# EAGLE schematic BreaV7 (EAGLE 9.2.2)

## Sheet 1 of 3
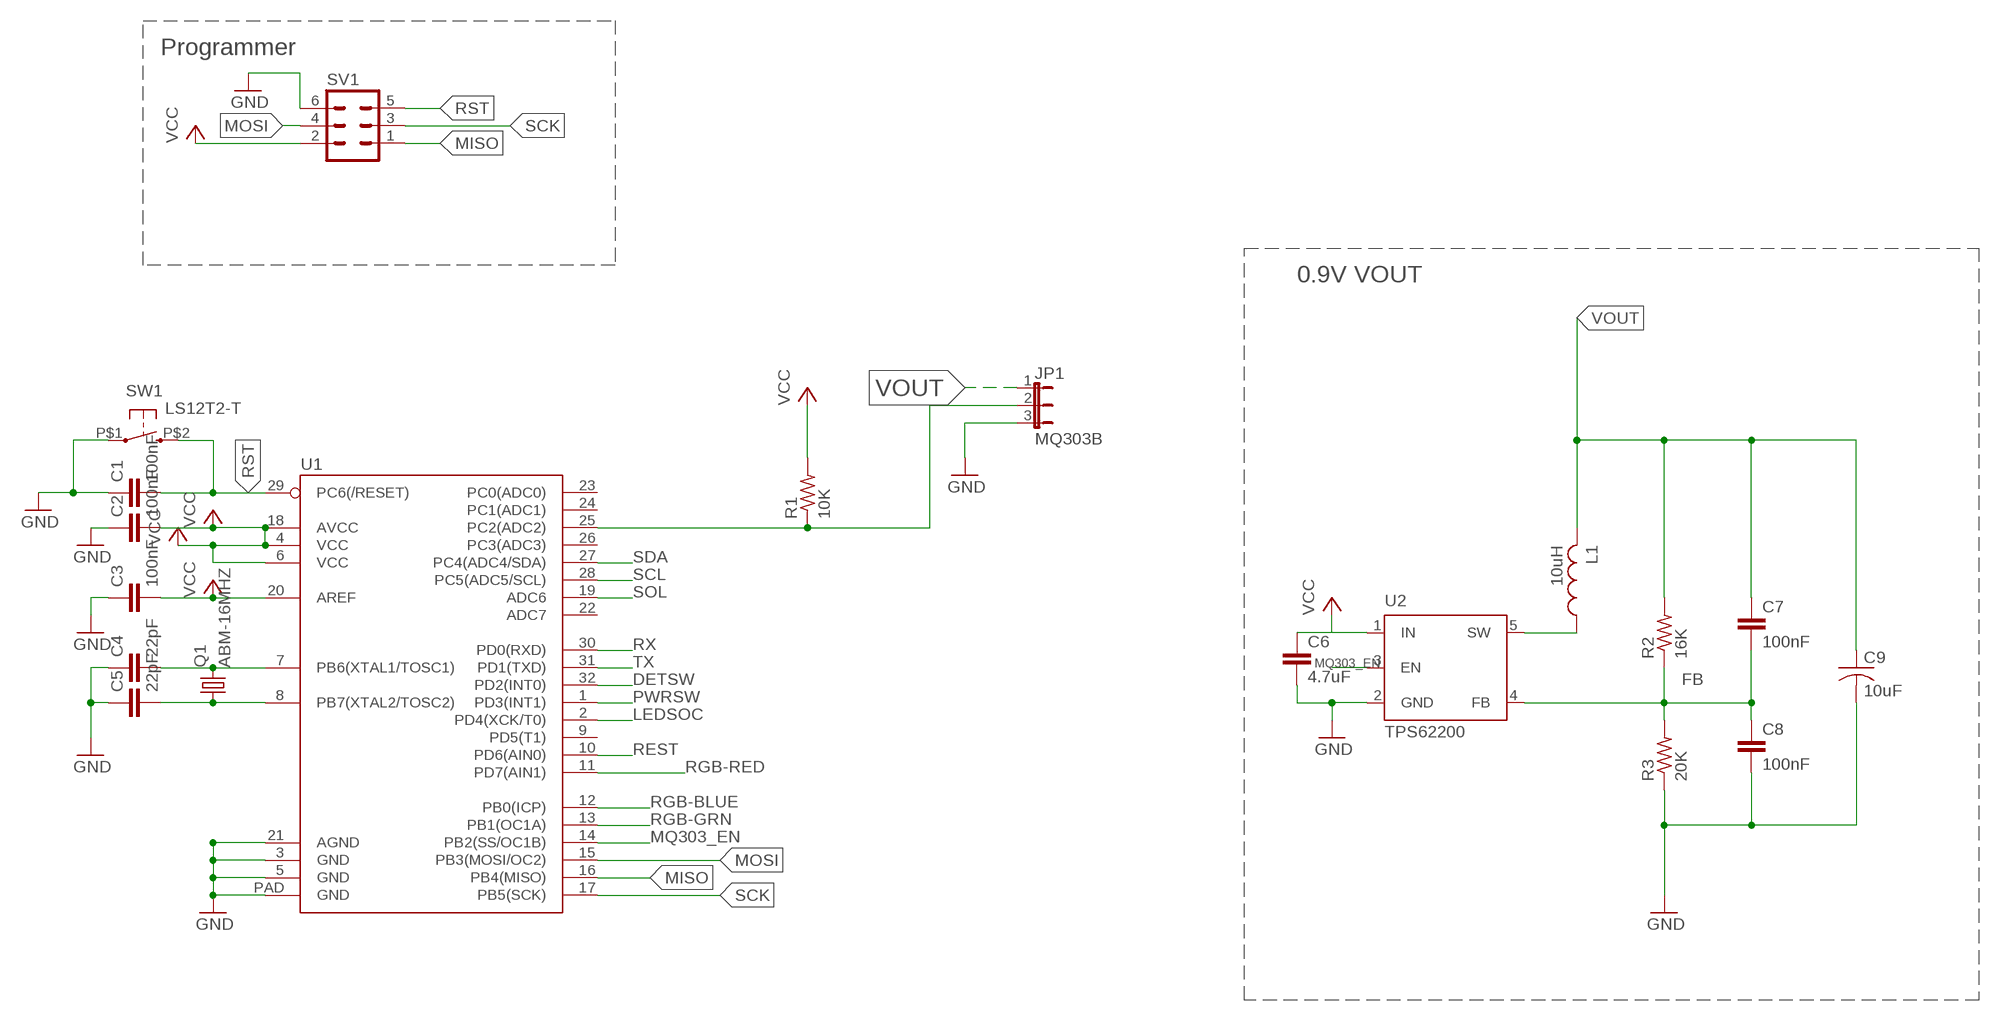
[diagram p0: schematic, sheet 1]

### Parts
C1  100nF  C-EUC0603  [C0603]
C2  100nF  C-EUC0603  [C0603]
C3  100nF  C-EUC0603  [C0603]
C4  22pF  C-EUC0603  [C0603]
C5  22pF  C-EUC0603  [C0603]
C6  4.7uF  C-EUC0402  [C0402]
C7  100nF  C-EUC0402  [C0402]
C8  100nF  C-EUC0402  [C0402]
C9  10uF  C-USC0805K  [C0805K]
JP1  MQ303B  JP2E  [JP2]
L1  10uH  L-USL2825P  [L2825P]
Q1  ABM-16MHZ  [ABM-16MHZ]
R1  10K  R-US_R0402  [R0402]
R2  16K  R-US_R0402  [R0402]
R3  20K  R-US_R0402  [R0402]
SV1  MA03-2  [MA03-2]
SW1  LS12T2-T  [LS12T2-T]
U1  ATMEGA328P_MLFMLF32  [MLF32-PAD]
U2  TPS62200  [TPS62200]

### Nets
DETSW: U1.32(PD2(INT0)) ; also sheet 2
FB: C7.2 C8.1 R2.1 R3.2 U2.4(FB)
GND: C1.1 C2.1 C3.1 C4.1 C5.1 C6.2 C8.2 C9.2 JP1.3 R3.1 SV1.6(MISO) SW1.P$1(S1) U1.3(GND) U1.5(GND) U1.21(AGND) U1.PAD(GND) U2.2(GND) ; also sheet 2,3
LEDSOC: U1.2(PD4(XCK/T0))
MISO: SV1.1 U1.16(PB4(MISO))
MOSI: SV1.4 U1.15(PB3(MOSI/OC2))
MQ303_EN: U1.14(PB2(SS/OC1B)) U2.3(EN)
N$1: C5.2 Q1.P$1 U1.8(PB7(XTAL2/TOSC2))
N$2: C4.2 Q1.P$2 U1.7(PB6(XTAL1/TOSC1))
N$3: JP1.2 R1.1 U1.25(PC2(ADC2))
N$7: C6.1 U2.1(IN)
PWRSW: U1.1(PD3(INT1)) ; also sheet 2
REST: U1.10(PD6(AIN0)) ; also sheet 2
RGB-BLUE: U1.12(PB0(ICP)) ; also sheet 2
RGB-GRN: U1.13(PB1(OC1A)) ; also sheet 2
RGB-RED: U1.11(PD7(AIN1)) ; also sheet 2
RST: C1.2 SV1.5(VTG) SW1.P$2(S2) U1.29(PC6(/RESET))
RX: U1.30(PD0(RXD)) ; also sheet 2
SCK: SV1.3 U1.17(PB5(SCK))
SCL: U1.28(PC5(ADC5/SCL)) ; also sheet 3
SDA: U1.27(PC4(ADC4/SDA)) ; also sheet 3
SOL: U1.19(ADC6) ; also sheet 2
SW: L1.1 U2.5(SW)
TX: U1.31(PD1(TXD)) ; also sheet 2
VCC: C2.2 C3.2 R1.2 SV1.2 U1.4(VCC) U1.6(VCC) U1.18(AVCC) U1.20(AREF) ; also sheet 2,3
VOUT: C7.1 C9.1 JP1.1 L1.2 R2.2
Unconnected: U1.9(PD5(T1)) U1.22(ADC7) U1.23(PC0(ADC0)) U1.24(PC1(ADC1)) U1.26(PC3(ADC3))

### Notes on the sheet
- Programmer
- 0.9V VOUT

## Sheet 2 of 3
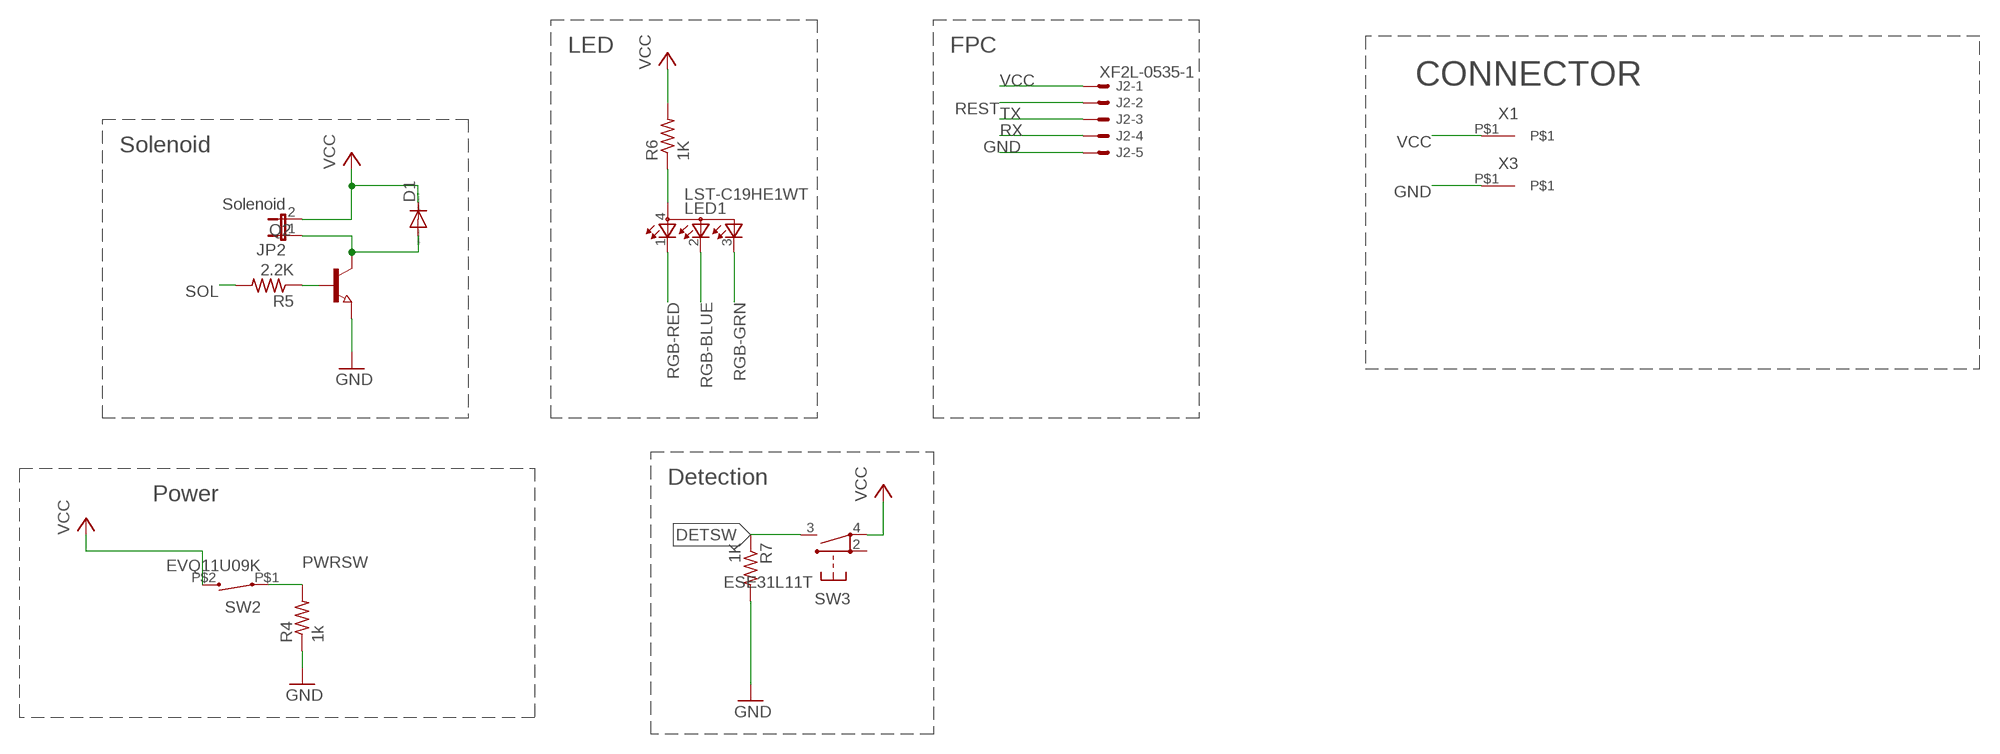
[diagram p1: schematic, sheet 2]

### Parts
D1  DIODE-SOD123  [SOD123]
J2  XF2L-0535-1  [XF2L-0535-1]
JP2  Solenoid  JP1E  [JP1]
LED1  LST-C19HE1WT  [LST-C19HE1WT]
Q2  NPN-TRANSISTOR_SOT23  [SOT23]
R4  1k  R-US_R0402  [R0402]
R5  2.2K  R-US_R0402  [R0402]
R6  1K  R-US_R0402  [R0402]
R7  1K  R-US_R0402  [R0402]
SW2  EVQ11U09K  [EVQ11U-09K]
SW3  ESE31L11T  [SWITCH]
X1  CON-1PIN  [CON-1PIN]
X3  CON-1PIN  [CON-1PIN]

### Nets
DETSW: R7.1 SW3.3 ; also sheet 1
GND: J2.5 Q2.2(E) R4.1 R7.2 X3.P$1 ; also sheet 1,3
N$5: LED1.4(A) R6.1
N$9: D1.A JP2.1 Q2.3(C)
N$10: Q2.1(B) R5.1
PWRSW: R4.2 SW2.P$1 ; also sheet 1
REST: J2.2 ; also sheet 1
RGB-BLUE: LED1.2(CGREEN) ; also sheet 1
RGB-GRN: LED1.3(CBLUE) ; also sheet 1
RGB-RED: LED1.1(CRED) ; also sheet 1
RX: J2.4 ; also sheet 1
SOL: R5.2 ; also sheet 1
TX: J2.3 ; also sheet 1
VCC: D1.C J2.1 JP2.2 R6.2 SW2.P$2 SW3.4(C3) X1.P$1 ; also sheet 1,3
Unconnected: SW3.2(C2)

### Notes on the sheet
- LED | FPC
- CONNECTOR
- Solenoid
- Detection
- Power

## Sheet 3 of 3
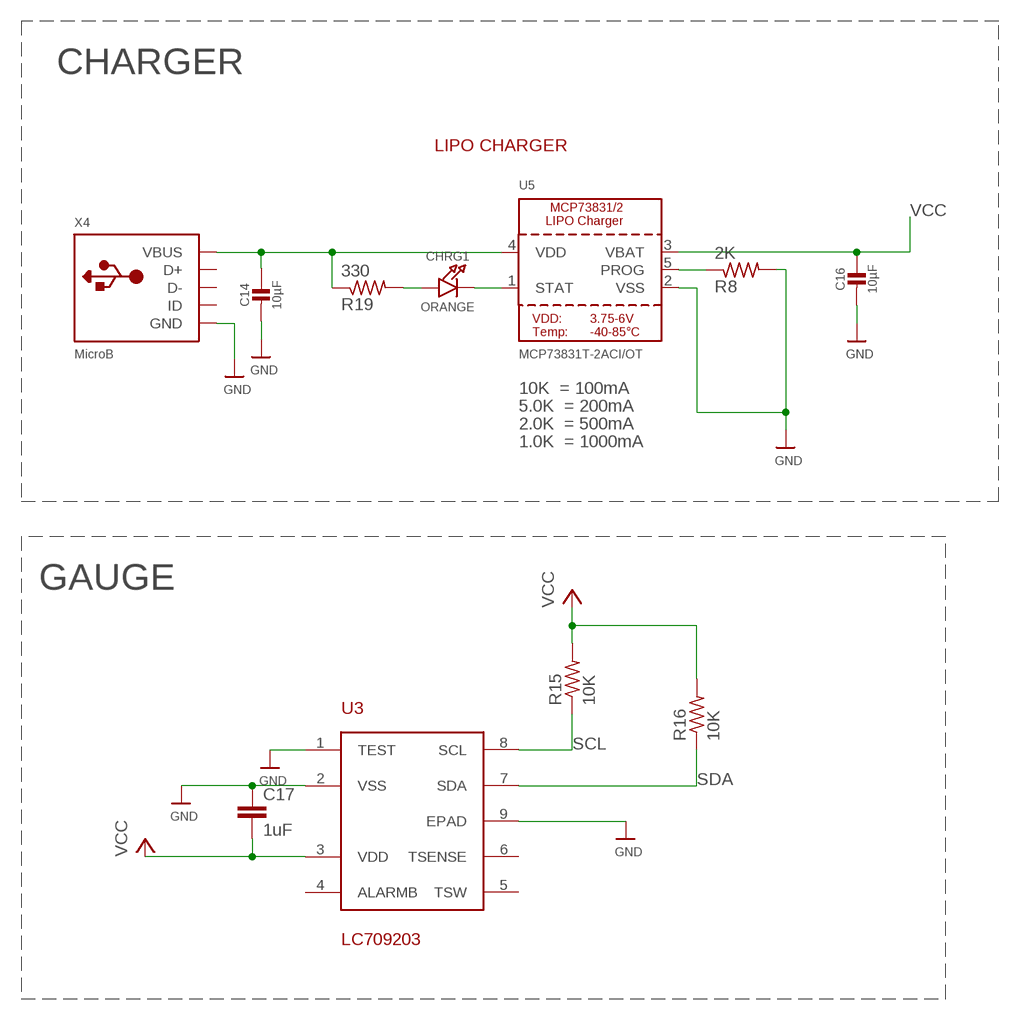
[diagram p2: schematic, sheet 3]

### Parts
C14  10µF  CAP_CERAMIC0805-NOOUTLINE  [0805-NO]
C16  10µF  CAP_CERAMIC0805-NOOUTLINE  [0805-NO]
C17  1uF  C-EUC0603  [C0603]
CHRG1  ORANGE  LED0805_NOOUTLINE  [CHIPLED_0805_NOOUTLINE]
R8  2K  R-US_R0402  [R0402]
R15  10K  R-US_R0402  [R0402]
R16  10K  R-US_R0402  [R0402]
R19  330  R-US_R0402  [R0402]
U3  LC709203  [WDFN8]
U5  MCP73831T-2ACI/OT  MCP73831/2  [SOT23-5]
X4  MicroB  USBMICRO_20329  [4UCONN_20329]

### Nets
GND: C14.2 C16.2 C17.1 R8.2 U3.1(TEST) U3.2(VSS) U3.9(EPAD) U5.2(VSS) X4.BASE@1(GND) X4.BASE@2(GND) X4.GND X4.SPRT@1(GND) X4.SPRT@2(GND) X4.SPRT@3(GND) X4.SPRT@4(GND) ; also sheet 1,2
N$12: R8.1 U5.5(PROG)
N$16: CHRG1.A R19.2
N$17: CHRG1.C U5.1(STAT)
SCL: R15.1 U3.8(SCL) ; also sheet 1
SDA: R16.1 U3.7(SDA) ; also sheet 1
VBUS2: C14.1 R19.1 U5.4(VDD) X4.VBUS
VCC: C16.1 C17.2 R15.2 R16.2 U3.3(VDD) U5.3(VBAT) ; also sheet 1,2
Unconnected: U3.4(ALARMB) U3.5(TSW) U3.6(TSENSE) X4.D+ X4.D- X4.ID

### Notes on the sheet
- CHARGER
- LIPO CHARGER
- 10K  = 100mA
- 5.0K  = 200mA
- 2.0K  = 500mA
- 1.0K  = 1000mA
- GAUGE

## Library data of the parts
C1-C8 C17 = rcl:C-EU: CAPACITOR, European symbol
C9 = resistor:C-US: CAPACITOR, American symbol
C14 C16 = microbuilder:CAP_CERAMIC: Ceramic Capacitors For new designs, use the packages preceded by an '_' character since they are more reliable: The following footprints should be used on most boards: _0402 - Standard footprint for regular board layouts _0603 - Standard footprint for regular board layouts _0805 - Standard footprint for regular board layouts _1206 - Standard footprint for regular board layouts For extremely tight-pitch boards where space is at a premium, the following 'micro-pitch' footprints can be used (smaller pads, no silkscreen outline, etc.): _0402MP - Micro-pitch footprint for very dense/compact boards _0603MP - Micro-pitch footprint for very dense/compact boards _0805MP - Micro-pitch footprint for very dense/compact boards _1206MP - Micro-pitch footprint for very dense/compact boards
CHRG1 = microbuilder:LED: LED 0603 - 0603 Surface Mount Package 2mA: Green LED - Low Power (3.9mcd, 2ma, 1.7Vf) - Digikey: 475-2709-2-ND Orange LED - Low Power (9.8mcd, 2ma, 1.8Vf) - Digikey: 475-1194-2-ND Red LED - Low Power (5mcd, 2ma, 1.8Vf) - Digikey: 475-1195-2-ND Yellow LED - Low Power (7mcd, 2ma, 1.8Vf) - Digikey: 475-1196-2-ND 5mA: Blue LED - Low Power (17mcd, 5ma, 2.9Vf) - Digikey: LNJ937W8CRACT-ND 0805 - 0805 Surface Mount Package 2mA: Red LED (8.8mcd, 2mA, 1.8Vf, Clear) - Low Power [Digikey: 475-2510-1-ND] Green LED (5mcd, 2mA, 1.8Vf, Clear) - Low Power [Digikey: 475-2730-1-ND] Yellow LED (11.3mcd, 2mA, 1.8Vf, Clear) - Low Power [Digikey: 475-2555-1-ND] 20mA: Red LED (104mcd, 20mA, Diffused) - LS R976 [Digikey: 475-1278-6-ND] Red LED (12mcd, 20mA, 2.0Vf, Clear) - APT2012EC [Digikey: 754-1128-1-ND] Green LED (15mcd, 20mA, 2.2Vf, Clear) - APT2012GC [Digikey: 754-1131-1-ND] Orange LED (160mcd, 20mA, 2.1Vf, Clear) - APT2012SECK [Digikey: 754-1130-1-ND] 1206 - 1206 Surface Mount Package Green LED (26mcd, 20mA, Diffused) - LG N971 [Digikey: 475-1407-6-ND] Red LED (15mcd, 20mA, Diffused) - LH N974 [Digikey: 475-1416-6-ND] Cree - Cree High-Power Surface Mount LEDs XPEBWT-L1-0000-00D50 - White 111lm 350mA 2.9Vf 6200K 110° XTEAWT-00-0000-00000LEE3 - White 114lm 350mA 2.85Vf 5000K 115° Everlight - Everlight 45-21 Series Surface Mount LEDs 45-21/QK2C-B2832AC2CB2/2T - Warm White 2000mcd 20mA 3.25Vf 3050K 120° 45-21/LK2C-B38452C4CB2/2T - Nuetral White 2000mcd 20mA 3.25Vf 4150K 120° 45-21/LK2C-B50634C6CB2/2T - Cold White 2200mcd 20mA 3.25Vf 5650K 120° PLCC2 Reverse Mount LS T77K-J1L2-1-0-2-R18-Z - Red 11.25mcd 2mA 1.8Vf 630nm 120° LO T77K-L1M2-24-Z - Orange 19.6mcd 2mA 1.8Vf 606nm 120° LY T77K-K2M1-26-Z - Yellow 15.7mcd 2mA 1.8Vf 587nm 120°
D1 = diode:DIODE-: DIODE
J2 = adafruit:XF2*-05?: OMRON FPC Connector Source : http://www.omron.com/ecb/products/pdf/fpc.pdf
JP1 = jumper:JP2E: JUMPER
JP2 = jumper:JP1E: JUMPER
L1 = resistor:L-US: INDUCTOR, American symbol
LED1 = led:LST-C19HE1WT
Q1 = NewPart:ABM-16MHZ: Crystal 16MHz 18pF
Q2 = semicon-smd-ipc:NPN-TRANSISTOR_: NPN TRANSISTOR
R1-R8 R15 R16 R19 = resistor:R-US_: RESISTOR, American symbol
SV1 = con-lstb:MA03-2: PIN HEADER; OC_FARNELL: unknown; OC_NEWARK: unknown
SW1 = NewPart:LS12T2-T: Side Switch for hardware reset
SW2 = NewPart:EVQ11U09K
SW3 = NewPart:ESE31L11T: Panasonic Detector Switch
U1 = SparkFun-DigitalIC:ATMEGA328P_MLF: 32-Pin Atmega328 part Commonly used on Arduino compatible boards Available in QFP and QFN packages TQFP is IC-09069 QFN is non-stock
U2 = NewPart:TPS62200: TI TPS62200 Buck Converter
U3 = NewPart:LC709203: 1-cell ON semiconductor gas gauge
U5 = microbuilder:MCP73831/2: MCP73831/2 LIPO Charger VDD: 3.75 - 6V Temp -40 - 85°C Programmable Charge Rate: 15-500mA NOTE: STAT is a tri-state logic output on the MCP73831 and an open-drain output on the MCP73832. SOT23-5 with 4.2V output and tri-state logic on STAT = MCP73831T-2ACI/OT
X1 X3 = NewPart:CON-1PIN: THROUGH HOLE FOR 1-PIN CONNECTOR
X4 = microbuilder:USB: USB Connectors USBMINIB - Surface Mount Female Mini-B USB Connector 4UConnector: 06564